# Altium schematic sheet Kivipallur_joonis1.SchDoc
size A4; SheetNumber: 2; SheetTotal: 4
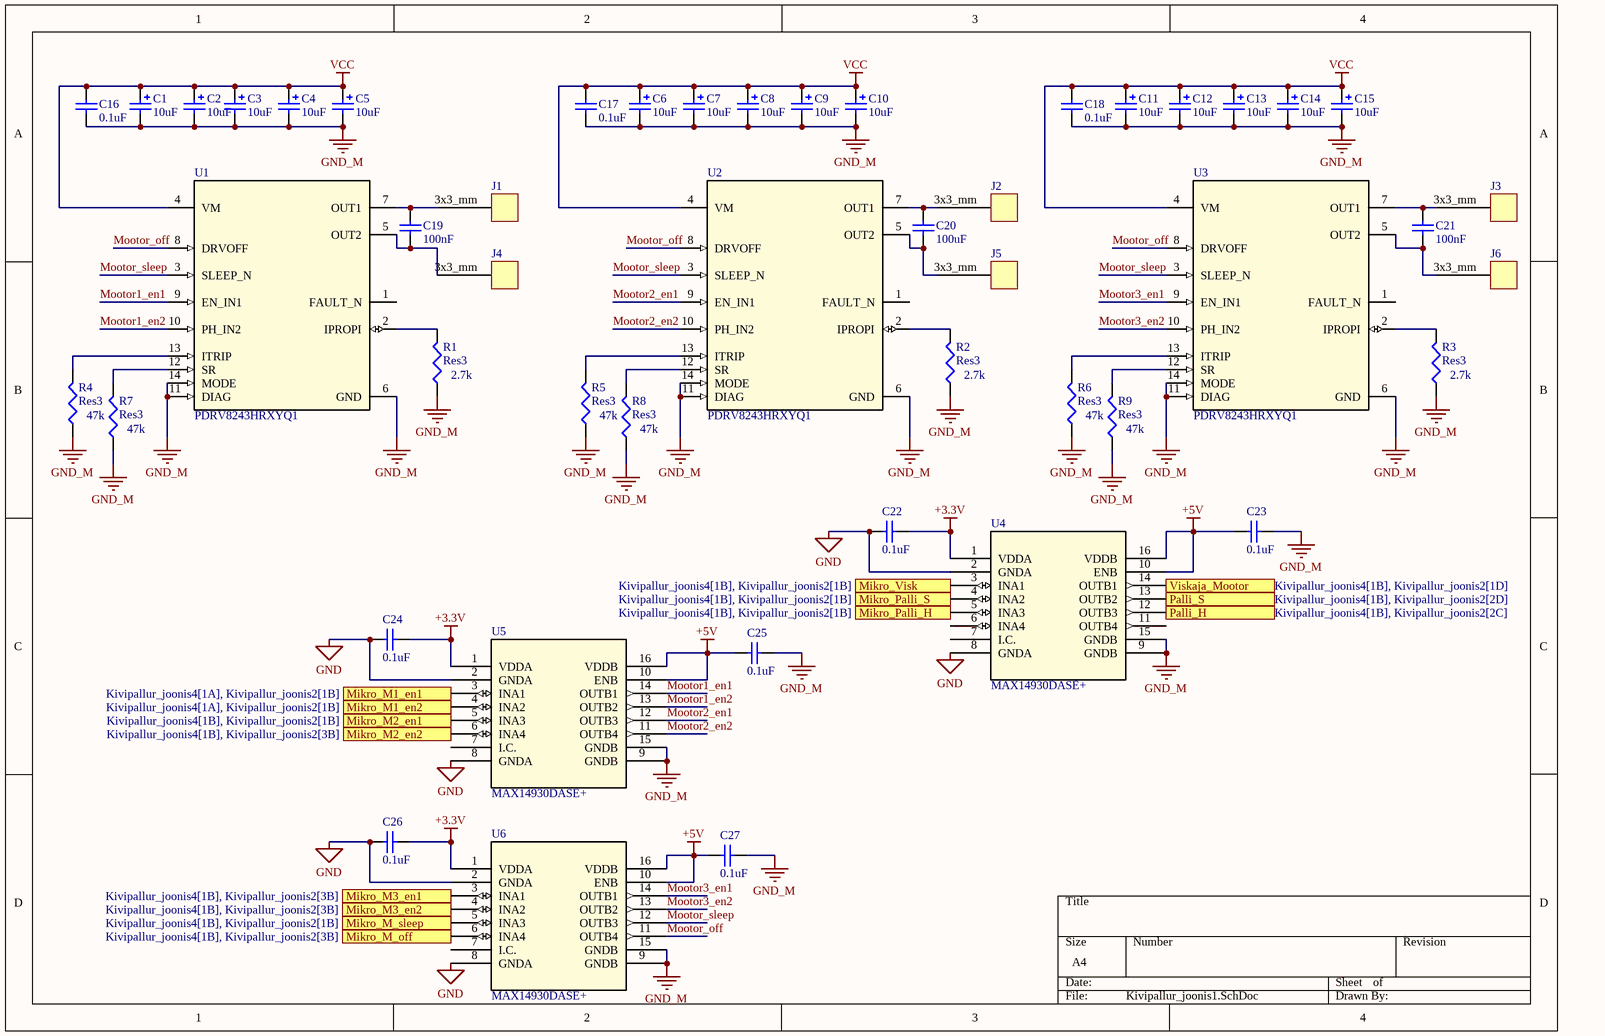
[diagram p0: Kivipallur_joonis1.SchDoc]

## Parts
C1  value 10uF  [C0805]  (hidden comment: Cap Pol3)
C2  value 10uF  [C0805]  (hidden comment: Cap Pol3)
C3  value 10uF  [C0805]  (hidden comment: Cap Pol3)
C4  value 10uF  [C0805]  (hidden comment: Cap Pol3)
C5  value 10uF  [C0805]  (hidden comment: Cap Pol3)
C6  value 10uF  [C0805]  (hidden comment: Cap Pol3)
C7  value 10uF  [C0805]  (hidden comment: Cap Pol3)
C8  value 10uF  [C0805]  (hidden comment: Cap Pol3)
C9  value 10uF  [C0805]  (hidden comment: Cap Pol3)
C10  value 10uF  [C0805]  (hidden comment: Cap Pol3)
C11  value 10uF  [C0805]  (hidden comment: Cap Pol3)
C12  value 10uF  [C0805]  (hidden comment: Cap Pol3)
C13  value 10uF  [C0805]  (hidden comment: Cap Pol3)
C14  value 10uF  [C0805]  (hidden comment: Cap Pol3)
C15  value 10uF  [C0805]  (hidden comment: Cap Pol3)
C16  value 0.1uF  [1608[0603]]  (hidden comment: Cap Semi)
C17  value 0.1uF  [1608[0603]]  (hidden comment: Cap Semi)
C18  value 0.1uF  [1608[0603]]  (hidden comment: Cap Semi)
C19  value 100nF  [1608[0603]]  (hidden comment: Cap Semi)
C20  value 100uF  [1608[0603]]  (hidden comment: Cap Semi)
C21  value 100nF  [1608[0603]]  (hidden comment: Cap Semi)
C22  value 0.1uF  [1608[0603]]  (hidden comment: Cap Semi)
C23  value 0.1uF  [1608[0603]]  (hidden comment: Cap Semi)
C24  value 0.1uF  [1608[0603]]  (hidden comment: Cap Semi)
C25  value 0.1uF  [1608[0603]]  (hidden comment: Cap Semi)
C26  value 0.1uF  [1608[0603]]  (hidden comment: Cap Semi)
C27  value 0.1uF  [1608[0603]]  (hidden comment: Cap Semi)
J1  3x3_mm  [3x3_mm]  (value not drawn)
J2  3x3_mm  [3x3_mm]  (value not drawn)
J3  3x3_mm  [3x3_mm]  (value not drawn)
J4  3x3_mm  [3x3_mm]  (value not drawn)
J5  3x3_mm  [3x3_mm]  (value not drawn)
J6  3x3_mm  [3x3_mm]  (value not drawn)
R1  Res3  value 2.7k  [J1-0603]
R2  Res3  value 2.7k  [J1-0603]
R3  Res3  value 2.7k  [J1-0603]
R4  Res3  value 47k  [J1-0603]
R5  Res3  value 47k  [J1-0603]
R6  Res3  value 47k  [J1-0603]
R7  Res3  value 47k  [J1-0603]
R8  Res3  value 47k  [J1-0603]
R9  Res3  value 47k  [J1-0603]
U1  PDRV8243HRXYQ1  [RXY0014A-MFG]
U2  PDRV8243HRXYQ1  [RXY0014A-MFG]
U3  PDRV8243HRXYQ1  [RXY0014A-MFG]
U4  MAX14930DASE+  [21-0041_S16+1_MXM]
U5  MAX14930DASE+  [21-0041_S16+1_MXM]
U6  MAX14930DASE+  [21-0041_S16+1_MXM]

## Ports
Mikro_M1_en1 (see Kivipallur_joonis4[1A], Kivipallur_joonis2[1B]), Mikro_M1_en2 (see Kivipallur_joonis4[1A], Kivipallur_joonis2[1B]), Mikro_M2_en1 (see Kivipallur_joonis4[1B], Kivipallur_joonis2[1B]), Mikro_M2_en2 (see Kivipallur_joonis4[1B], Kivipallur_joonis2[3B]), Mikro_M3_en1 (see Kivipallur_joonis4[1B], Kivipallur_joonis2[3B]), Mikro_M3_en2 (see Kivipallur_joonis4[1B], Kivipallur_joonis2[3B]), Mikro_M_off (see Kivipallur_joonis4[1B], Kivipallur_joonis2[3B]), Mikro_M_sleep (see Kivipallur_joonis4[1B], Kivipallur_joonis2[1B]), Mikro_Palli_H (see Kivipallur_joonis4[1B], Kivipallur_joonis2[1B]), Mikro_Palli_S (see Kivipallur_joonis4[1B], Kivipallur_joonis2[1B]), Mikro_Visk (see Kivipallur_joonis4[1B], Kivipallur_joonis2[1B]), Palli_H (see Kivipallur_joonis4[1B], Kivipallur_joonis2[2C]), Palli_S (see Kivipallur_joonis4[1B], Kivipallur_joonis2[2D]), Viskaja_Mootor (see Kivipallur_joonis4[1B], Kivipallur_joonis2[1D])

## Nets
+3.3V: C22.2 C24.2 C26.2 U4.1(VDDA) U5.1(VDDA) U6.1(VDDA)
+5V: C23.1 C25.1 C27.1 U4.10(ENB) U4.16(VDDB) U5.10(ENB) U5.16(VDDB) U6.10(ENB) U6.16(VDDB)
GND: C22.1 C24.1 C26.1 U4.2(GNDA) U4.8(GNDA) U5.2(GNDA) U5.8(GNDA) U6.2(GNDA) U6.8(GNDA)
GND_M: C1.2 C2.2 C3.2 C4.2 C5.2 C6.2 C7.2 C8.2 C9.2 C10.2 C11.2 C12.2 C13.2 C14.2 C15.2 C16.1 C17.1 C18.1 C23.2 C25.2 C27.2 R1.1 R2.1 R3.1 R4.1 R5.1 R6.1 R7.1 R8.1 R9.1 U1.6(GND) U1.11(DIAG) U1.14(MODE) U2.6(GND) U2.11(DIAG) U2.14(MODE) U3.6(GND) U3.11(DIAG) U3.14(MODE) U4.9(GNDB) U4.15(GNDB) U5.9(GNDB) U5.15(GNDB) U6.9(GNDB) U6.15(GNDB)
VCC: C1.1 C2.1 C3.1 C4.1 C5.1 C6.1 C7.1 C8.1 C9.1 C10.1 C11.1 C12.1 C13.1 C14.1 C15.1 C16.2 C17.2 C18.2 U1.4(VM) U2.4(VM) U3.4(VM)
Mikro_M1_en1: U5.3(INA1) ; port Mikro_M1_en1
Mikro_M1_en2: U5.4(INA2) ; port Mikro_M1_en2
Mikro_M2_en1: U5.5(INA3) ; port Mikro_M2_en1
Mikro_M2_en2: U5.6(INA4) ; port Mikro_M2_en2
Mikro_M3_en1: U6.3(INA1) ; port Mikro_M3_en1
Mikro_M3_en2: U6.4(INA2) ; port Mikro_M3_en2
Mikro_M_off: U6.6(INA4) ; port Mikro_M_off
Mikro_M_sleep: U6.5(INA3) ; port Mikro_M_sleep
Mikro_Palli_H: U4.5(INA3) ; port Mikro_Palli_H
Mikro_Palli_S: U4.4(INA2) ; port Mikro_Palli_S
Mikro_Visk: U4.3(INA1) ; port Mikro_Visk
Mootor1_en1: U1.9(EN_IN1) U5.14(OUTB1)
Mootor1_en2: U1.10(PH_IN2) U5.13(OUTB2)
Mootor2_en1: U2.9(EN_IN1) U5.12(OUTB3)
Mootor2_en2: U2.10(PH_IN2) U5.11(OUTB4)
Mootor3_en1: U3.9(EN_IN1) U6.14(OUTB1)
Mootor3_en2: U3.10(PH_IN2) U6.13(OUTB2)
Mootor_off: U1.8(DRVOFF) U2.8(DRVOFF) U3.8(DRVOFF) U6.11(OUTB4)
Mootor_sleep: U1.3(SLEEP_N) U2.3(SLEEP_N) U3.3(SLEEP_N) U6.12(OUTB3)
Palli_H: U4.12(OUTB3) ; port Palli_H
Palli_S: U4.13(OUTB2) ; port Palli_S
Viskaja_Mootor: U4.14(OUTB1) ; port Viskaja_Mootor
NetC19_1: C19.1 J4.3x3_mm U1.5(OUT2)
NetC19_2: C19.2 J1.3x3_mm U1.7(OUT1)
NetC20_1: C20.1 J5.3x3_mm U2.5(OUT2)
NetC20_2: C20.2 J2.3x3_mm U2.7(OUT1)
NetC21_1: C21.1 J6.3x3_mm U3.5(OUT2)
NetC21_2: C21.2 J3.3x3_mm U3.7(OUT1)
NetR1_2: R1.2 U1.2(IPROPI)
NetR2_2: R2.2 U2.2(IPROPI)
NetR3_2: R3.2 U3.2(IPROPI)
NetR4_2: R4.2 U1.13(ITRIP)
NetR5_2: R5.2 U2.13(ITRIP)
NetR6_2: R6.2 U3.13(ITRIP)
NetR7_2: R7.2 U1.12(SR)
NetR8_2: R8.2 U2.12(SR)
NetR9_2: R9.2 U3.12(SR)

Not connected (* = marked no-connect by the designer): U1 1(FAULT_N); U2 1(FAULT_N); U3 1(FAULT_N); U4 6(INA4) 7(I.C.) 11(OUTB4); U5 7(I.C.); U6 7(I.C.)

## Library data of the parts
C1-C15 = Cap Pol3: Polarized Capacitor (Surface Mount); Published: 8-Jun-2000; PackageReference: C0805; Publisher: Altium Limited; PackageDescription: Chip Capacitor; LatestRevisionDate: 29-May-2009; LatestRevisionNote: IPC-7351 Footprint Added.
C16-C27 = Cap Semi: Capacitor (Semiconductor SIM Model); Published: 8-Jun-2000; PackageReference: C1206; Publisher: Altium Limited; PackageDescription: Chip Capacitor; LatestRevisionDate: 29-May-2009; LatestRevisionNote: IPC-7351 Footprint Added.
R1-R9 = Res3: Resistor; Published: 8-Jun-2000; LatestRevisionDate: 29-May-2009; LatestRevisionNote: IPC-7351 Footprint Added.; PackageReference: J1-0603; Publisher: Altium Limited; PackageDescription: Chip Resistor
U1-U3 = PDRV8243HRXYQ1: No Description Available; Mfr_Name: Texas Instruments; Type: DEV; RefDes: RefDes; Copyright: Copyright (C) 2022 Ultra Librarian. All rights reserved.; Manufacturer_Part_Number: PDRV8243HRXYQ1
U4-U6 = MAX14930DASE+_1: No Description Available; Mfr_Name: Maxim Integrated Products; Copyright: Copyright (C) 2022 Ultra Librarian. All rights reserved.; Manufacturer_Part_Number: MAX14930DASE+; RefDes: RefDes; Type: DEV